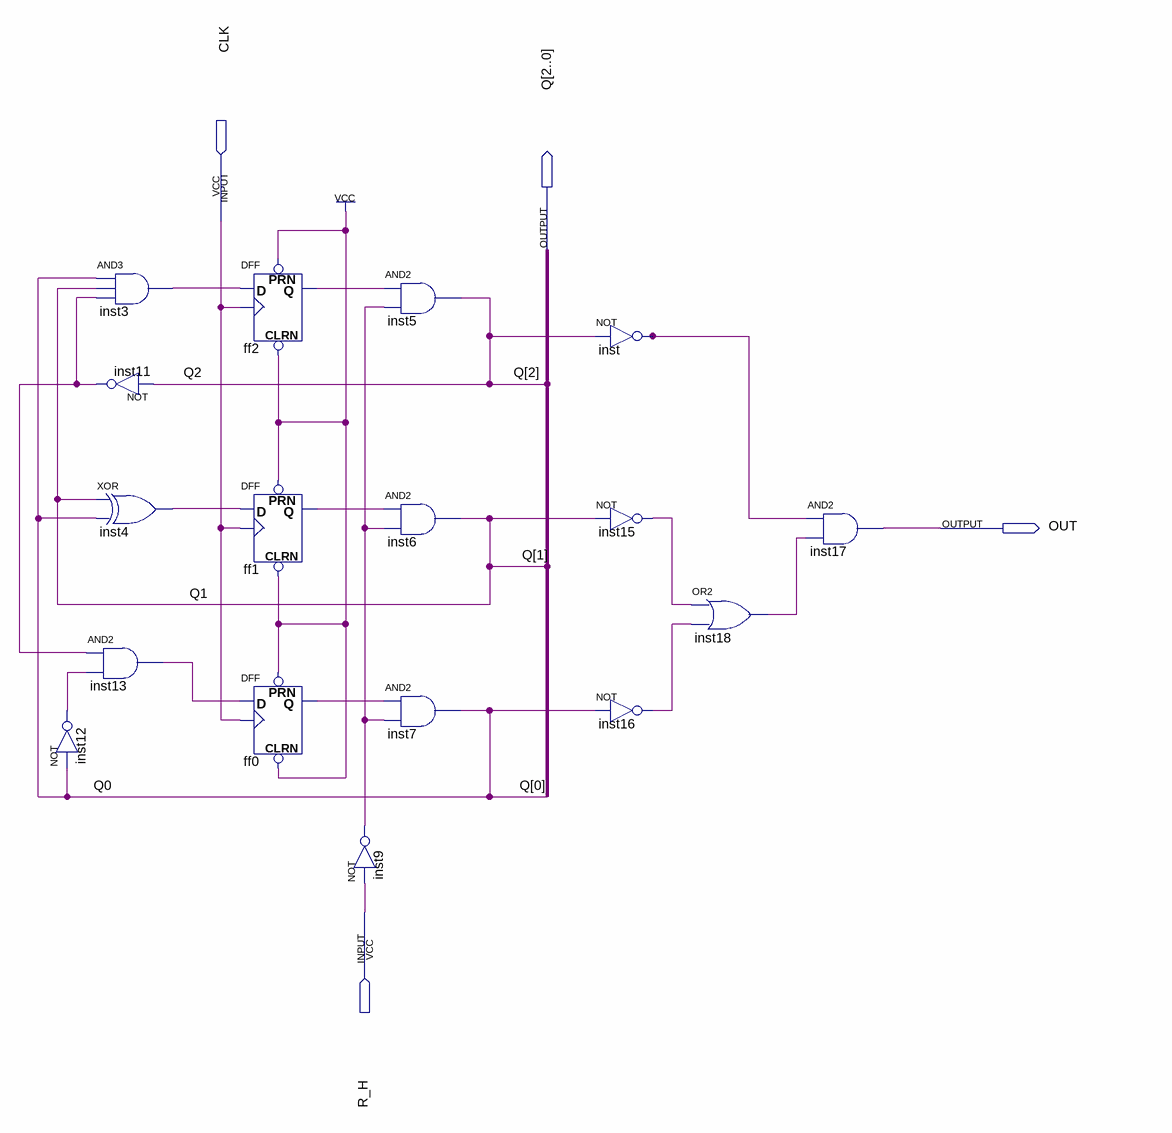
[diagram p0: schematic sheet]
// Quartus schematic enunciado1.bdf as structural Verilog: 17 symbols, 4 pins
module enunciado1 (
  input  CLK,
  input  R_H,
  output [2:0] Q,
  output OUT
);

  wire ff0_q, ff1_q, ff2_q, inst3_out, inst4_out, inst9_out, inst11_out, inst12_out, inst13_out, inst15_out,
       inst16_out, inst18_out, inst_out;

  not inst12 (inst12_out, Q[0]);
  and inst3 (inst3_out, Q[0], Q[1], inst11_out);
  not inst11 (inst11_out, Q[2]);
  xor inst4 (inst4_out, Q[1], Q[0]);
  and inst13 (inst13_out, inst11_out, inst12_out);
  DFF ff2 (.CLRN(1'b1), .CLK(CLK), .D(inst3_out), .PRN(1'b1), .Q(ff2_q));
  DFF ff1 (.CLRN(1'b1), .CLK(CLK), .D(inst4_out), .PRN(1'b1), .Q(ff1_q));
  DFF ff0 (.CLRN(1'b1), .CLK(CLK), .D(inst13_out), .PRN(1'b1), .Q(ff0_q));
  not inst9 (inst9_out, R_H);
  and inst5 (Q[2], ff2_q, inst9_out);
  and inst6 (Q[1], ff1_q, inst9_out);
  and inst7 (Q[0], ff0_q, inst9_out);
  not inst (inst_out, Q[2]);
  not inst15 (inst15_out, Q[1]);
  not inst16 (inst16_out, Q[0]);
  or inst18 (inst18_out, inst15_out, inst16_out);
  and inst17 (OUT, inst_out, inst18_out);
endmodule
